# EAGLE design Heat Sensing Device (EAGLE 6.6.0)
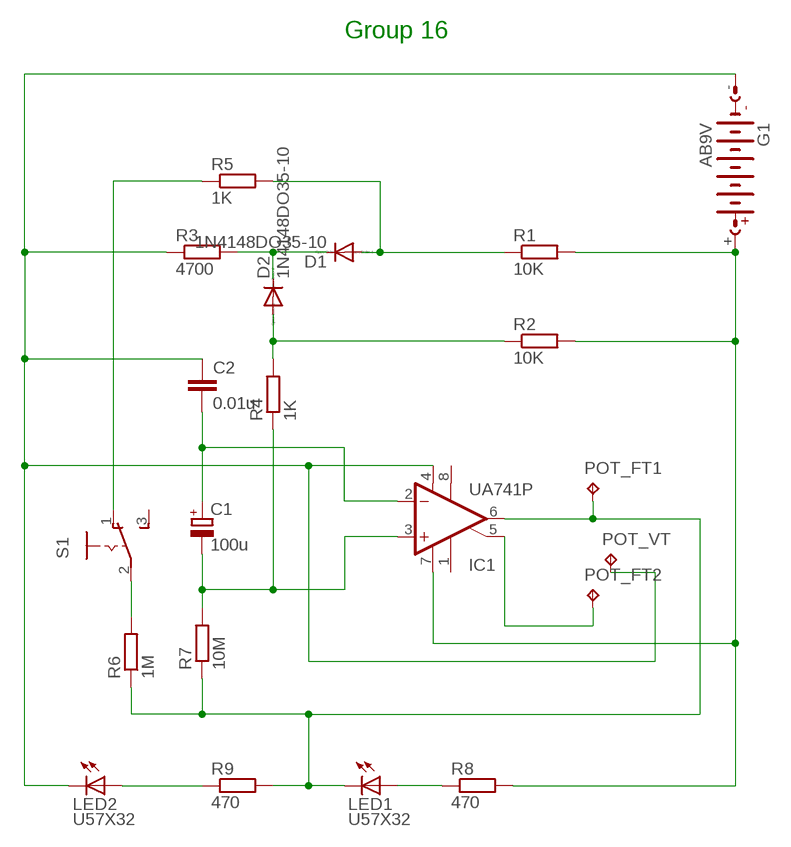
[diagram p0: schematic, sheet 1]

## Parts
C1  100u  CPOL-EUE5-10.5  [E5-10,5]
C2  0.01u  C-EU025-050X050  [C025-050X050]
D1  1N4148DO35-10  [DO35-10]
D2  1N4148DO35-10  [DO35-10]
G1  AB9V  [AB9V]
IC1  UA741P  [DIL08]
LED1  U57X32  [U57X32]
LED2  U57X32  [U57X32]
POT_FT1  TPPAD1-17  [P1-17]
POT_FT2  TPPAD1-17  [P1-17]
POT_VT  TPPAD1-17  [P1-17]
R1  10K  R-EU_0204/5  [0204/5]
R2  10K  R-EU_0204/5  [0204/5]
R3  4700  R-EU_0204/5  [0204/5]
R4  1K  R-EU_0204/5  [0204/5]
R5  1K  R-EU_0204/5  [0204/5]
R6  1M  R-EU_0204/5  [0204/5]
R7  10M  R-EU_0204/5  [0204/5]
R8  470  R-EU_0204/5  [0204/5]
R9  470  R-EU_0204/5  [0204/5]
S1  255SB  [255SB]

## Nets
N$1: D1.A R1.1 R5.2
N$2: D1.C D2.C R3.2
N$3: C1.- IC1.3(+IN) R4.1 R7.2
N$4: LED2.A R9.1
N$5: R5.1 S1.1(O)
N$6: LED1.A R8.1
N$7: C1.+ C2.2 IC1.2(-IN)
N$8: IC1.5(ON2) POT_FT2.TP
N$9: IC1.6(OUT) LED1.K(C) POT_FT1.TP R6.1 R7.1 R9.2
N$10: D2.A R2.1 R4.2
N$11: C2.1 G1.- IC1.4(V-) LED2.K(C) POT_VT.TP R3.1
N$12: R6.2 S1.2(P)
N$14: G1.+ IC1.7(V+) R1.2 R2.2 R8.2
Unconnected: IC1.1(ON1) IC1.8(OPT) S1.3(S)

## Notes on the sheet
- Group 16

## Library data of the parts
C1 = resistor:CPOL-EU: POLARIZED CAPACITOR, European symbol
C2 = resistor:C-EU: CAPACITOR, European symbol
D1 D2 = diode:1N4148: DIODE high speed (Philips)
G1 = battery:AB9V: 9-V BATTERY CLIP
IC1 = linear:*741: OP AMP
LED1 LED2 = led:U57X32: LED rectangle, 5.7 x 3.2 mm
POT_FT1 POT_FT2 POT_VT = testpad:TP: Test pad
R1-R9 = rcl:R-EU_: RESISTOR, European symbol
S1 = switch:255SB: SLIDING SWITCH Distributor Buerklin, 11G810

## Board
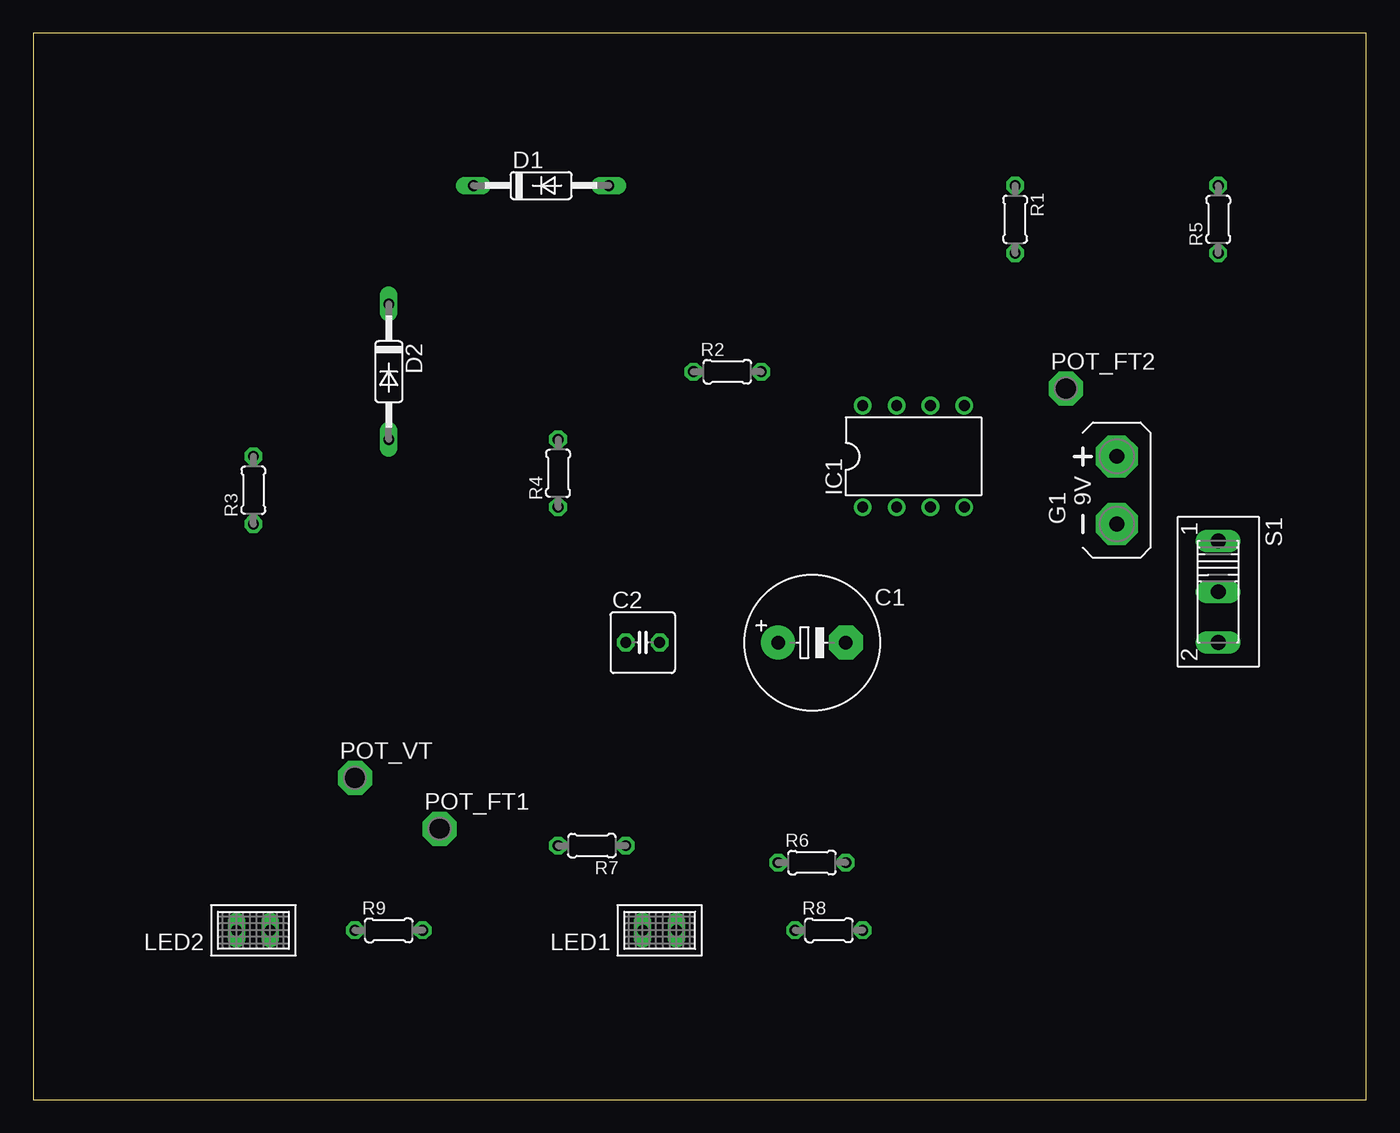
[diagram p1: board, top side]
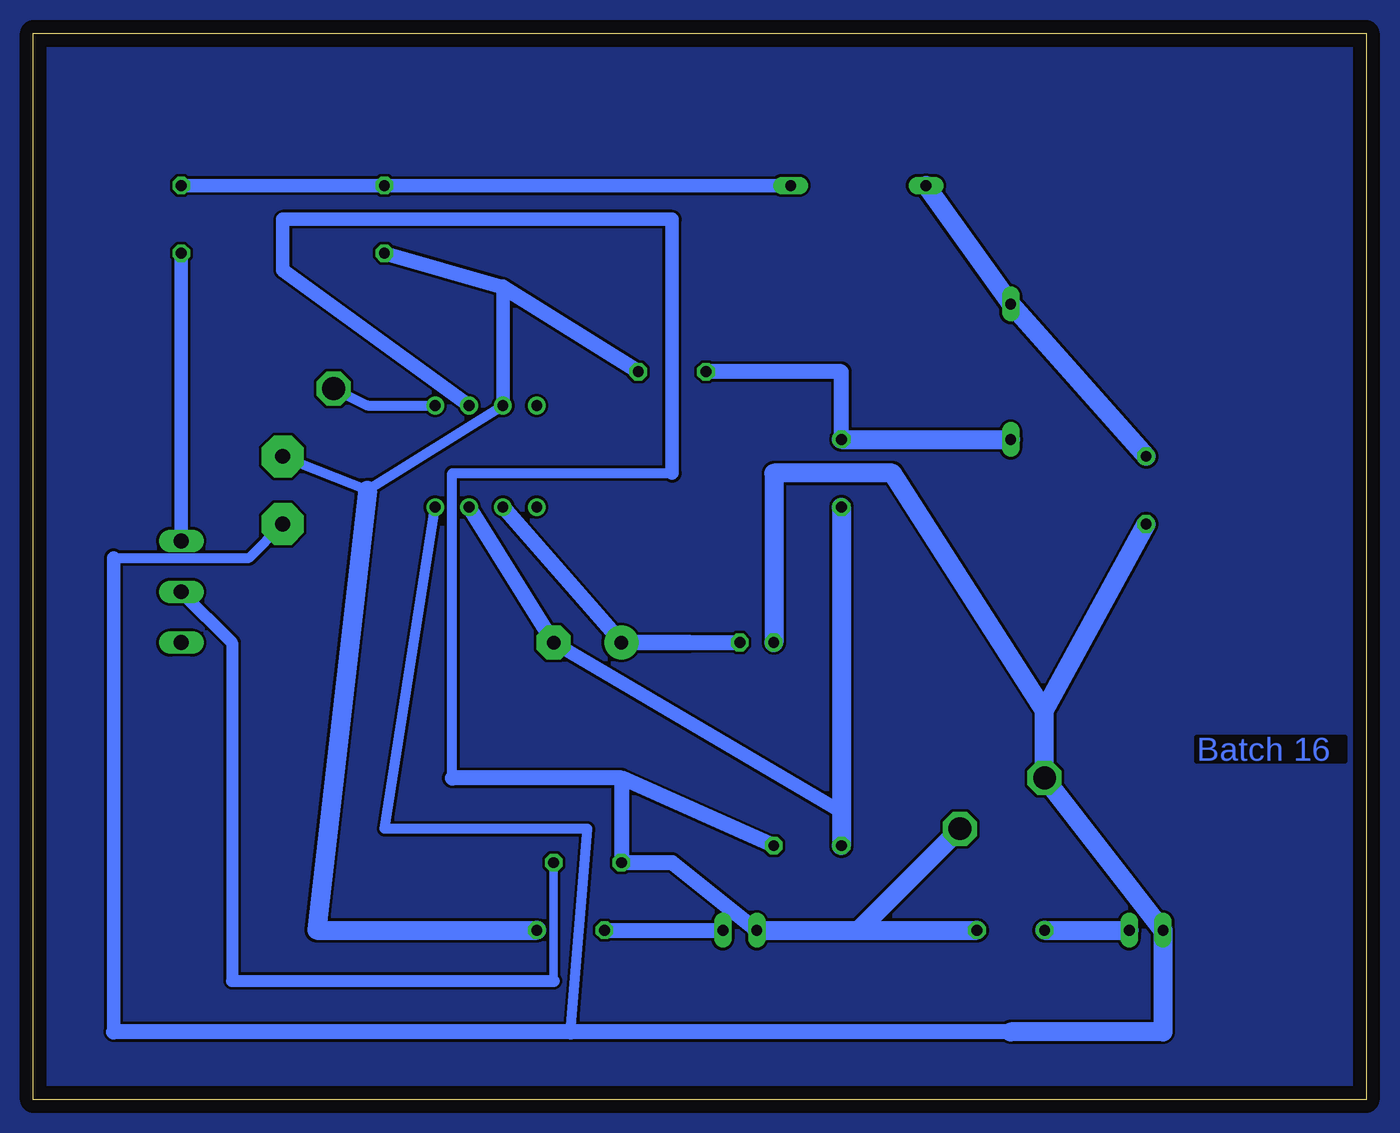
[diagram p2: board, bottom side, seen from below]

Size 100 x 80 mm. Coordinates in mm from the lower left corner, seen from the top.
Outline: 0,0 100,0 100,80 0,80 0,0
Copper layers (1*16): Top 0.035mm / dielectric 1.5mm / Bottom 0.035mm
Design rules "default": minimum track width 10mil, minimum drill 24mil, track to track 8mil, track to pad 8mil, pad to pad 8mil, via to via 8mil, smd to smd 8mil, copper to edge 40mil, drill to drill 8mil, minimum pad ring 10mil, minimum via ring 8mil, stop-mask expansion 4mil, vias tented up to drill 0mil, thermal gap 10mil

### Footprints (pad centres in the part's own frame; a part is rotated, then mirrored left to right if it is on the bottom)
E5-10,5 = drill 1.016 pad 2.54: + -2.54,0 | drill 1.016 pad 2.54 octagon: - 2.54,0
C025-050X050 = drill 0.813 octagon: 1 -1.27,0; 2 1.27,0
DO35-10 = drill 0.813 long: A 5.08,0; C -5.08,0
AB9V = drill 1.118 pad 3.15 octagon: + 0,2.54; - 0,-2.54
DIL08 = drill 0.813 pad 1.27: 1 -3.81,-3.81; 2 -1.27,-3.81; 3 1.27,-3.81; 4 3.81,-3.81; 5 3.81,3.81; 6 1.27,3.81; 7 -1.27,3.81; 8 -3.81,3.81
U57X32 = drill 0.813 long: A -1.27,0; K 1.27,0
P1-17 = drill 1.702 pad 2.54 octagon: TP 0,0
0204/5 = drill 0.813 octagon: 1 -2.54,0; 2 2.54,0
255SB = drill 1.118 long: 1 -3.81,0; 2 0,0; 3 3.81,0

### Placement (x,y rotation side)
C1  58.42,34.29 0 top
C2  45.72,34.29 0 top
D1  38.1,68.58 0 top
D2  26.67,54.61 270 top
G1  81.28,45.72 0 top
IC1  66.04,48.26 0 top
LED1  46.99,12.7 180 top
LED2  16.51,12.7 180 top
POT_FT1  30.48,20.32 0 top
POT_FT2  77.47,53.34 0 top
POT_VT  24.13,24.13 0 top
R1  73.66,66.04 270 top
R2  52.07,54.61 0 top
R3  16.51,45.72 90 top
R4  39.37,46.99 90 top
R5  88.9,66.04 90 top
R6  58.42,17.78 0 top
R7  41.91,19.05 180 top
R8  59.69,12.7 0 top
R9  26.67,12.7 0 top
S1  88.9,38.1 270 top

### Tracks (layer width: path | path; a pad name or v marks a point on that pad's centre or on a via)
N$1
  Bottom 1.016: D1.A R1.1 R5.2
N$2
  Bottom 1.422: R3.2 D2.C D1.C
N$3
  Bottom 1.016: 39.37,21.59 C1.-
  Bottom 1.143: C1.- IC1.3
  Bottom 1.422: R4.1 39.37,21.59 R7.2
N$4
  Bottom 1.422: R9.1 LED2.A
N$5
  Bottom 1.016: S1.1 R5.1
N$6
  Bottom 1.143: R8.1 LED1.A
N$7
  Bottom 1.143: 50.8,34.29 C2.2 | C1.+ IC1.2
  Bottom 1.168: C1.+ 50.8,34.29
N$8
  Bottom 0.762: IC1.5 74.93,52.07 POT_FT2.TP
N$9
  Bottom 0.762: 52.07,46.99 68.58,46.99 68.58,24.13
  Bottom 1.016: IC1.6 81.28,62.23 81.28,66.04 52.07,66.04 52.07,46.99
  Bottom 1.143: 55.88,24.13 R6.1 52.07,17.78 LED1.K | R7.1 55.88,24.13 | 55.88,24.13 68.58,24.13
  Bottom 1.422: LED1.K 38.1,12.7 | 38.1,12.7 R9.2 | 38.1,12.7 POT_FT1.TP
N$10
  Bottom 1.143: R2.1 39.37,54.61 R4.2
  Bottom 1.422: R4.2 D2.A
N$11
  Bottom 0.762: IC1.4 73.66,20.32 58.42,20.32 59.69,5.08 | G1.- 83.82,40.64 93.98,40.64
  Bottom 1.016: 93.98,5.08 93.98,40.64
  Bottom 1.143: 26.67,5.08 59.69,5.08 93.98,5.08
  Bottom 1.422: 24.13,29.21 R3.1 | 24.13,29.21 POT_VT.TP LED2.K 15.24,5.08 26.67,5.08 | C2.1 44.45,46.99 35.56,46.99 24.13,29.21
N$12
  Bottom 0.635: 60.96,8.89 R6.2
  Bottom 0.889: 60.96,8.89 85.09,8.89 85.09,34.29 S1.2
N$13
  pour Bottom: -3.81,82.55 106.68,82.55 106.68,-6.35 111.76,-11.43 0,-11.43 -6.35,-5.08 -6.35,80.01
N$14
  Bottom 0.762: G1.+ 74.93,45.72 IC1.7
  Bottom 1.016: 64.77,60.96 IC1.7
  Bottom 1.143: R2.2 64.77,60.96 R1.2
  Bottom 1.422: R8.2 78.74,12.7 74.93,45.72

### Text on the board
Bottom: Batch 16